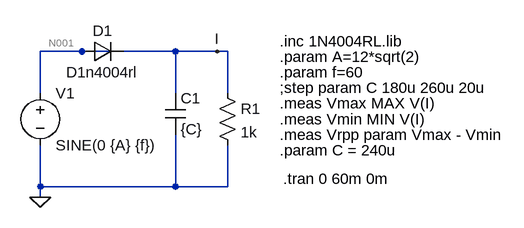
[diagram p0: schematic rectificador1.asc]
rectificador1.asc, the LTspice schematic file:
Version 4
SHEET 1 880 680
WIRE 112 64 48 64
WIRE 160 64 112 64
WIRE 256 64 176 64
WIRE 320 64 256 64
WIRE 336 64 320 64
WIRE 48 128 48 64
WIRE 256 128 256 64
WIRE 336 128 336 64
WIRE 48 272 48 208
WIRE 256 272 256 192
WIRE 256 272 48 272
WIRE 336 272 336 208
WIRE 336 272 256 272
WIRE 48 288 48 272
FLAG 48 288 0
FLAG 320 64 I
SYMBOL diode 112 80 R270
WINDOW 0 32 32 VTop 2
WINDOW 3 0 32 VBottom 2
SYMATTR InstName D1
SYMATTR Value D1n4004rl
SYMBOL voltage 48 112 R0
WINDOW 123 0 0 Left 0
WINDOW 39 0 0 Left 0
SYMATTR InstName V1
SYMATTR Value SINE(0 {A} {f})
SYMBOL cap 240 128 R0
SYMATTR InstName C1
SYMATTR Value {C}
SYMBOL res 320 112 R0
SYMATTR InstName R1
SYMATTR Value 1k
TEXT 416 48 Left 2 !.inc 1N4004RL.lib
TEXT 416 72 Left 2 !.param A=12*sqrt(2)
TEXT 416 96 Left 2 !.param f=60
TEXT 416 120 Left 2 !;step param C 180u 260u 20u
TEXT 416 144 Left 2 !.meas Vmax MAX V(I)
TEXT 416 168 Left 2 !.meas Vmin MIN V(I)
TEXT 416 192 Left 2 !.meas Vrpp param Vmax - Vmin
TEXT 422 260 Left 2 !.tran 0 60m 0m
TEXT 416 216 Left 2 !.param C = 240u

The netlist it stands for:
* rectificador1.asc
D1 N001 I D1n4004rl
V1 N001 0 SINE(0 {A} {f})
C1 I 0 {C}
R1 I 0 1k
.model D D
.lib standard.dio
.inc 1N4004RL.lib
.param A=12*sqrt(2)
.param f=60
;step param C 180u 260u 20u
.meas Vmax MAX V(I)
.meas Vmin MIN V(I)
.meas Vrpp param Vmax - Vmin
.tran 0 60m 0m
.param C = 240u
.backanno
.end

* Results of the author's LTspice run, read from the files saved beside the schematic
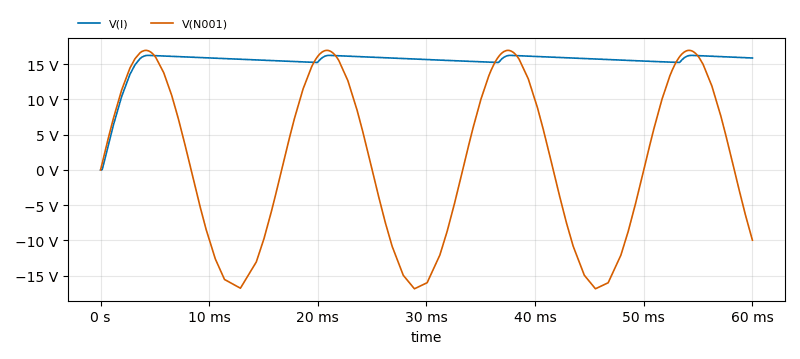
[diagram p1: Transient Analysis of rectificador1.asc, plotted from the saved traces]
* Transient Analysis, 1 run:
*   V(I): min 0 V, max 16.26 V, average 15.38 V, rms 15.52 V, last 15.89 V
*   V(N001): min -16.88 V, max 16.97 V, average 1.397 V, rms 11.83 V, last -9.975 V
* From the log:
*   vmax: MAX(v(i))=16.2565 FROM 0 TO 0.06
*   vmin: MIN(v(i))=0 FROM 0 TO 0.06
*   vrpp: vmax - vmin=16.2565